# Altium schematic sheet BlinkerAC.SchDoc
size A4
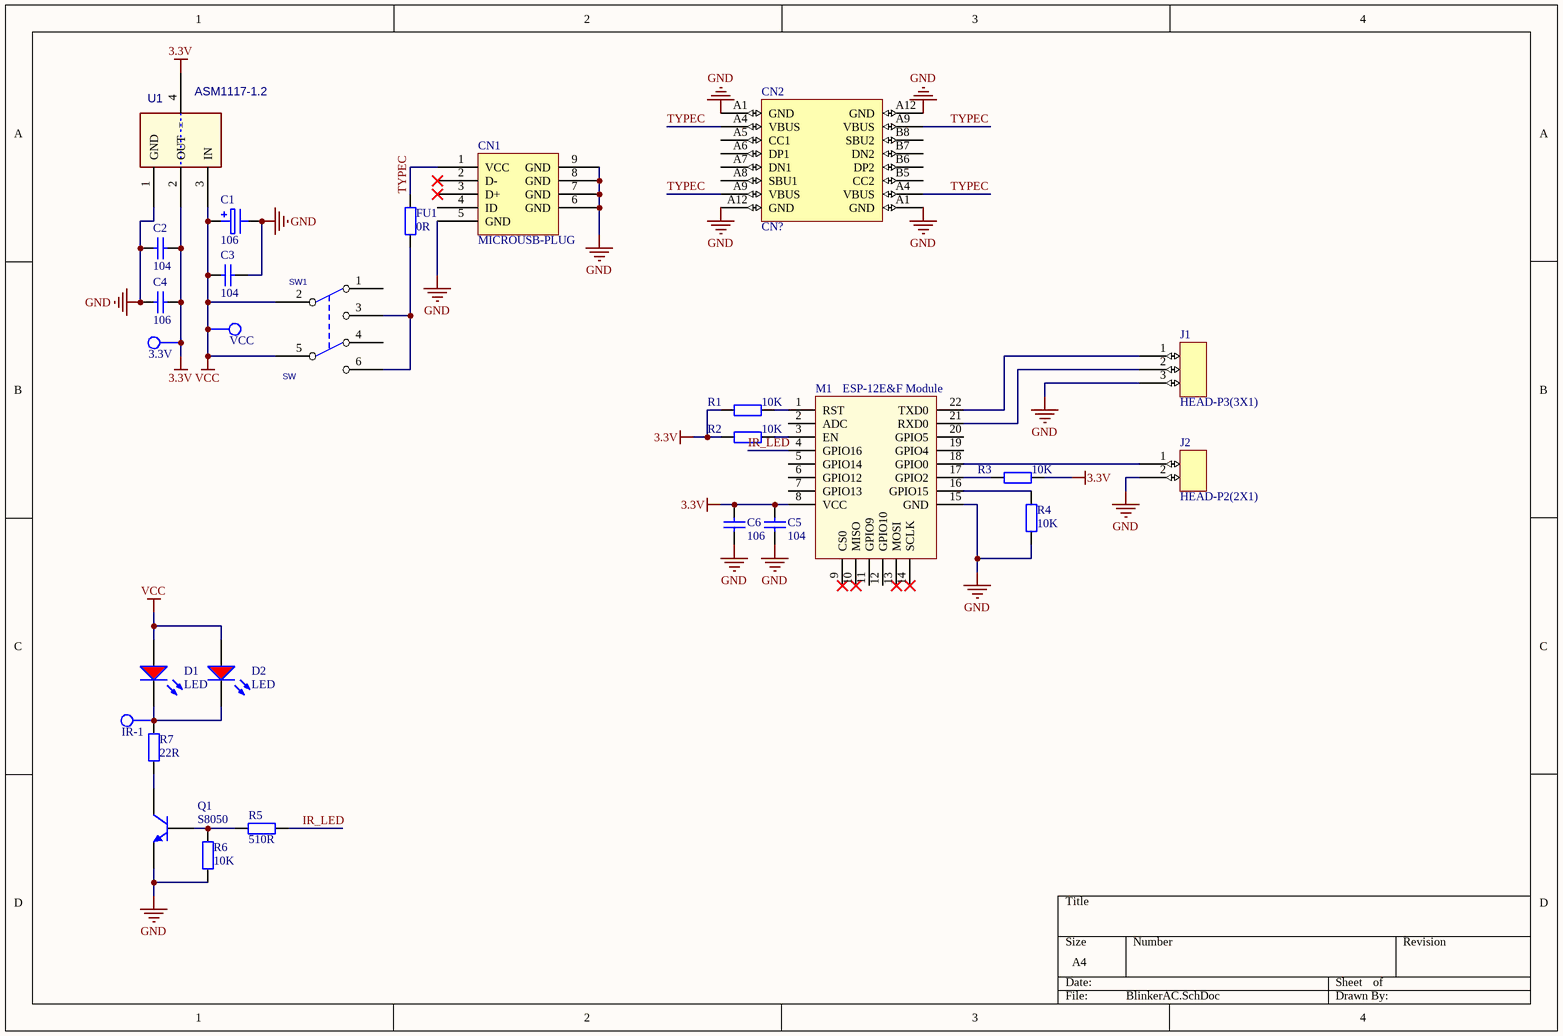
[diagram p0: BlinkerAC.SchDoc]

## Parts
3.3V  TP  [TEST 1.2]  (value not drawn)
C1  106  [CASE-A_3216]
C2  104  [0603_C]
C3  104  [0603_C]
C4  106  [0805_C]
C5  104  [0402_C]
C6  106  [0805_C]
CN1  MICROUSB-PLUG  [Mini_USB]
CN2  CN?  [type-c]
D1  LED  [LED 5MM-R]
D2  LED  [LED 5MM-R]
FU1  0R  [0805_R]
IR-1  TP  [TEST 1.2]  (value not drawn)
J1  HEAD-P3(3X1)  [2.54mm PIN3 (3X1)]
J2  HEAD-P2(2X1)  [2.54mm PIN2 (2X1)]
M1  ESP-12E&F Module  [ESP-12E&F Module]
Q1  S8050  [SOT-23(SOT-23-3)]
R1  10K  [0402_R]
R2  10K  [0402_R]
R3  10K  [0402_R]
R4  10K  [0402_R]
R5  510R  [0402_R]
R6  10K  [0402_R]
R7  22R  [0402_R]
SW1  SW  [KEY_DPDT]
U1  ASM1117-1.2  [SOT223]
VCC  TP  [TEST 1.2]  (value not drawn)

## Nets
3.3V: 3.3V.1(TP) C2.1 C4.1 C5.2 C6.1 M1.8(VCC) R1.2 R2.2 R3.1 U1.2(OUT) U1.4(=)
GND: C1.2 C2.2 C3.1 C4.2 C5.1 C6.2 CN1.5(GND) CN1.6(GND) CN1.7(GND) CN1.8(GND) CN1.9(GND) CN2.A1(GND) CN2.A12(GND) J1.3 J2.2 M1.15(GND) Q1.2(E) R4.1 R6.2 U1.1(GND)
VCC: C1.1 C3.2 D1.A D2.A SW1.2(COMMON1) SW1.5(COMMON2) U1.3(IN) VCC.1(TP)
IR_LED: M1.4(GPIO16) R5.1
TYPEC: CN1.1(VCC) CN2.A4(VBUS) CN2.A9(VBUS) FU1.1
NetD1_K: D1.K D2.K IR-1.1(TP) R7.1
NetFU1_2: FU1.2 SW1.3(NO1) SW1.6(NO2)
NetJ1_1: J1.1 M1.22(TXD0)
NetJ1_2: J1.2 M1.21(RXD0)
NetJ2_1: J2.1 M1.18(GPIO0)
NetM1_1: M1.1(RST) R1.1
NetM1_3: M1.3(EN) R2.1
NetM1_16: M1.16(GPIO15) R4.2
NetM1_17: M1.17(GPIO2) R3.2
NetQ1_1: Q1.1(B) R5.2 R6.1
NetQ1_3: Q1.3(C) R7.2

Not connected (* = marked no-connect by the designer): CN1 2(D-)* 3(D+)* 4(ID); CN2 A5(CC1) A6(DP1) A7(DN1) A8(SBU1) B5(CC2) B6(DP2) B7(DN2) B8(SBU2); M1 2(ADC) 5(GPIO14) 6(GPIO12) 7(GPIO13) 9(CS0)* 10(MISO)* 11(GPIO9) 12(GPIO10) 13(MOSI)* 14(SCLK)* 19(GPIO4) 20(GPIO5); SW1 1(NC1) 4(NC2)

## Library data of the parts
C1 = Capacity_Murphy: POLAR
C2-C6 = Capacity_ceramic_Murphy: ceramic; ComponentLink1Description: 供应商链接; ComponentLink1URL: http://www.szlcsc.com/product/details_53938.html; Package: 0402; Supplier: LC; SuppliersPartNumber: C52923
CN2 = TYPEC16-PLUG
D1 D2 = LED_Murphy: LED（Red）; ComponentLink1Description: 供应商链接; ComponentLink1URL: http://www.szlcsc.com/product/details_2659.html; Package: 0603; Supplier: LC; SuppliersPartNumber: C2286
FU1 R1-R7 = Resistor_Murphy: 电阻; ComponentLink1Description: 供应商链接; ComponentLink1URL: http://www.szlcsc.com/product/details_21904.html; Package: 0603; Supplier: LC; SuppliersPartNumber: C21190
Q1 = S8050: NPN Transistor
SW1 = SW KEY-DPDT
U1 = ASM1117-1.2: LDO